# EAGLE design eDice-v1.2 (EAGLE 5.10)
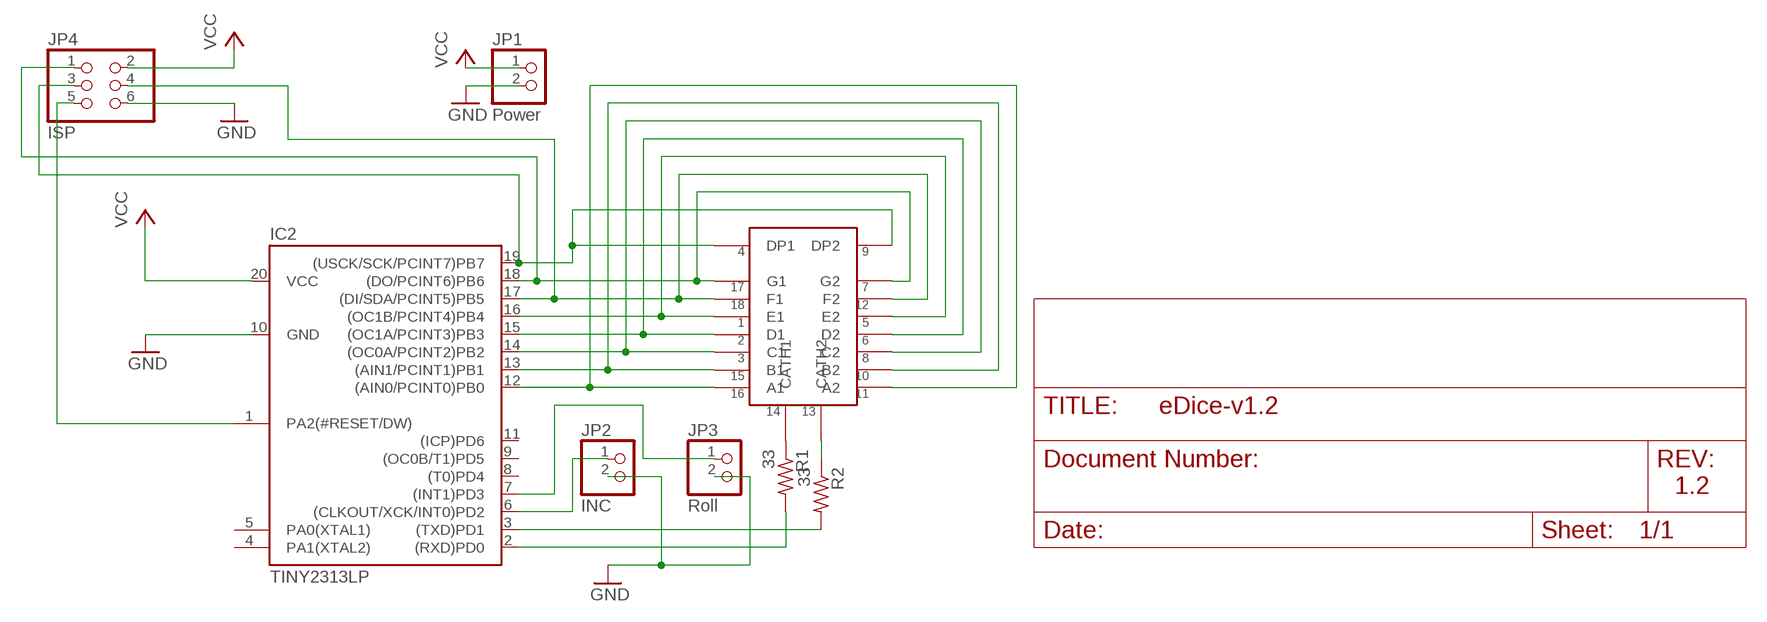
[diagram p0: schematic, sheet 1]

## Parts
IC2  TINY2313LP  [DIL20]
JP1  Power  PINHD-1X2  [1X02]
JP2  INC  PINHD-1X2  [1X02]
JP3  Roll  PINHD-1X2  [1X02]
JP4  ISP  PINHD-2X3  [2X03]
R1  33  R-US_0207/10  [0207/10]
R2  33  R-US_0207/10  [0207/10]
U$1  DUAL7SEGMENTLED  [DUAL7-SEGMENTLED]

## Nets
GND: IC2.10(GND) JP1.2 JP2.2 JP3.2 JP4.6
N$1: IC2.6((CLKOUT/XCK/INT0)PD2) JP2.1
N$2: IC2.7((INT1)PD3) JP3.1
N$3: IC2.12((AIN0/PCINT0)PB0) U$1.A1 U$1.A2
N$4: IC2.13((AIN1/PCINT1)PB1) U$1.B1 U$1.B2
N$5: IC2.14((OC0A/PCINT2)PB2) U$1.C1 U$1.C2
N$6: IC2.15((OC1A/PCINT3)PB3) U$1.D1 U$1.D2
N$7: IC2.16((OC1B/PCINT4)PB4) U$1.E1 U$1.E2
N$8: IC2.17((DI/SDA/PCINT5)PB5) JP4.4 U$1.F1 U$1.F2
N$9: R2.1 U$1.CATH2
N$10: IC2.19((USCK/SCK/PCINT7)PB7) JP4.3 U$1.DP1 U$1.DP2
N$11: R1.1 U$1.CATH1
N$12: IC2.18((DO/PCINT6)PB6) JP4.1 U$1.G1 U$1.G2
N$14: IC2.2((RXD)PD0) R1.2
N$15: IC2.3((TXD)PD1) R2.2
N$19: IC2.1(PA2(#RESET/DW)) JP4.5
VCC: IC2.20(VCC) JP1.1 JP4.2
Unconnected: IC2.4(PA1(XTAL2)) IC2.5(PA0(XTAL1)) IC2.8((T0)PD4) IC2.9((OC0B/T1)PD5) IC2.11((ICP)PD6)

## Notes on the sheet
- 1.2

## Library data of the parts
IC2 = minipov:TINY2313: 8-bit AVR Microcontroller with 2K Bytes Flash Source: http://www.atmel.com .. doc1477.pdf
JP1-JP3 = pinhead:PINHD-1X2: PIN HEADER
JP4 = pinhead:PINHD-2X3: PIN HEADER
R1 R2 = resistor:R-US_: RESISTOR, American symbol
U$1 = mkp:DUAL7SEGMENTLED: Dual 7 segment LED

## Board
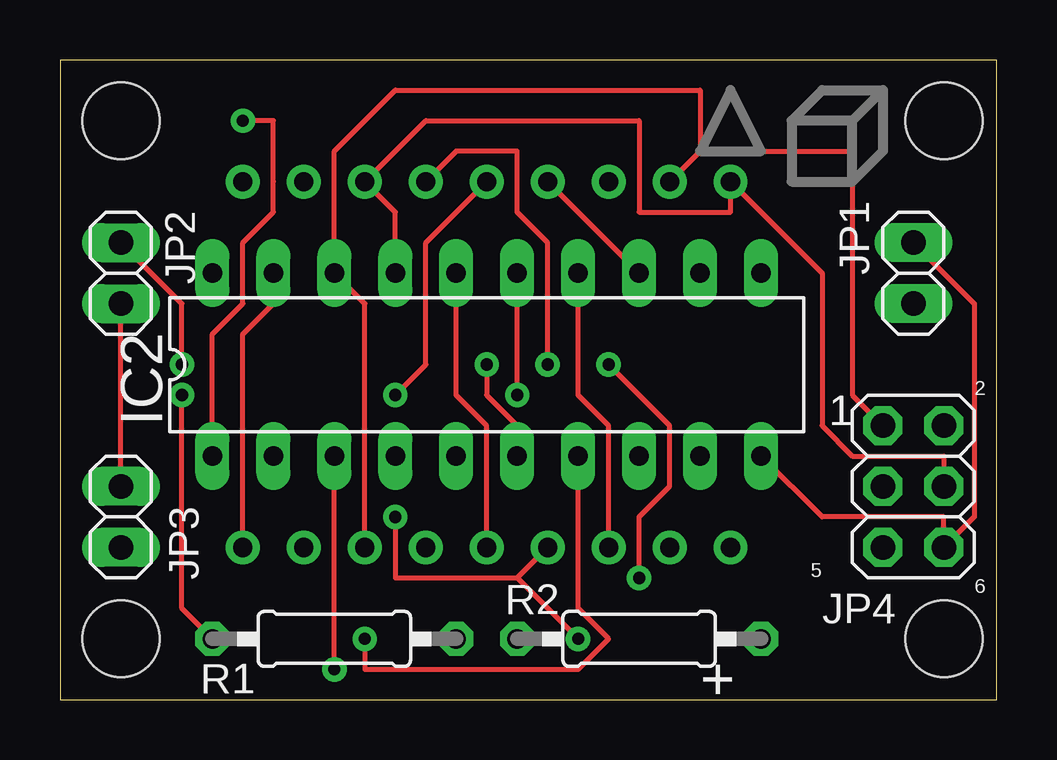
[diagram p1: board, top side]
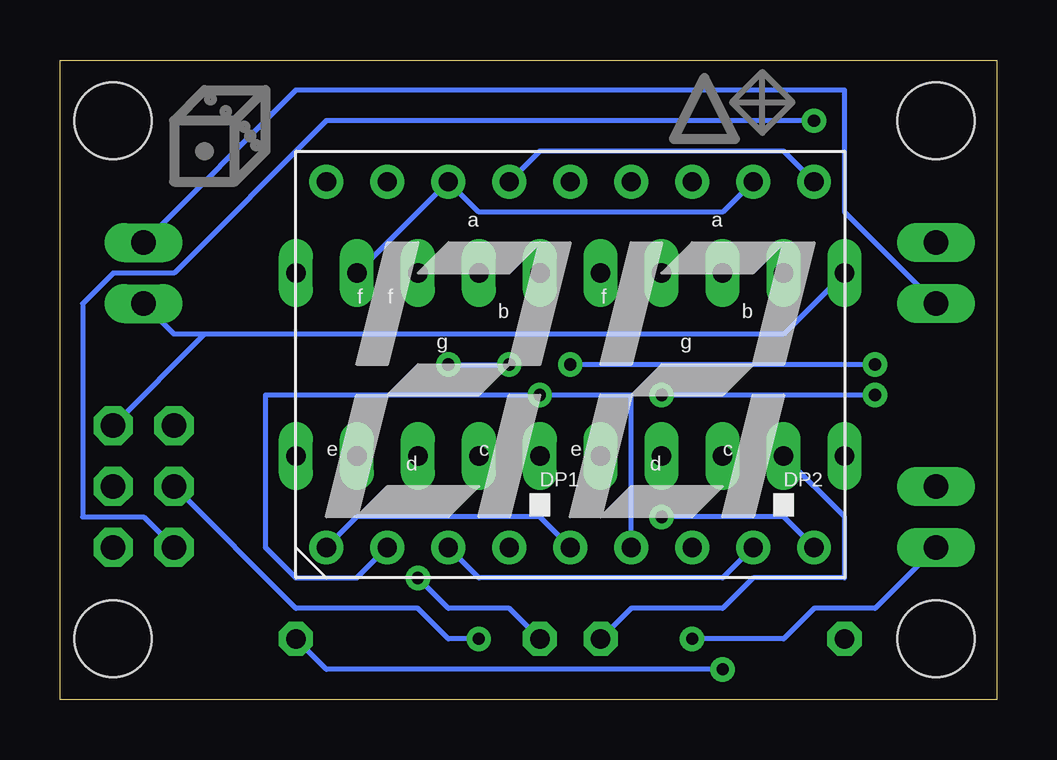
[diagram p2: board, bottom side, seen from below]

Size 39.04 x 26.66 mm. Coordinates in mm from the lower left corner, seen from the top.
Outline: 0,0 39.04,0 39.04,26.66 0,26.66 0,0
Copper layers (1*16): Top 0.035mm / dielectric 1.5mm / Bottom 0.035mm
Design rules "SparkFun": minimum track width 8mil, minimum drill 20mil, track to track 8mil, track to pad 8mil, pad to pad 8mil, via to via 8mil, smd to smd 8mil, copper to edge 10mil, drill to drill 8mil, minimum pad ring 12mil, minimum via ring 10mil, stop-mask expansion 4mil, vias tented up to drill 25mil, thermal gap 10mil
Holes 3.2 mm at 2.54,24.13 2.54,2.54 36.83,2.54 36.83,24.13

### Footprints (pad centres in the part's own frame; a part is rotated, then mirrored left to right if it is on the bottom)
DIL20 = drill 0.813 long: 1 -11.43,-3.81; 2 -8.89,-3.81; 3 -6.35,-3.81; 4 -3.81,-3.81; 5 -1.27,-3.81; 6 1.27,-3.81; 7 3.81,-3.81; 8 6.35,-3.81; 9 8.89,-3.81; 10 11.43,-3.81; 11 11.43,3.81; 12 8.89,3.81; 13 6.35,3.81; 14 3.81,3.81; 15 1.27,3.81; 16 -1.27,3.81; 17 -3.81,3.81; 18 -6.35,3.81; 19 -8.89,3.81; 20 -11.43,3.81
1X02 = drill 1.016 long: 1 -1.27,0; 2 1.27,0
2X03 = drill 1.016 octagon: 1 -2.54,-1.27; 2 -2.54,1.27; 3 0,-1.27; 4 0,1.27; 5 2.54,-1.27; 6 2.54,1.27
0207/10 = drill 0.813 octagon: 1 -5.08,0; 2 5.08,0
DUAL7-SEGMENTLED = drill 0.8 round: A1 -5.08,7.62; A2 7.62,7.62; B1 -2.54,7.62; B2 10.16,7.62; C1 -5.08,-7.62; C2 7.62,-7.62; CATH1 0,7.62; CATH2 2.54,7.62; D1 -7.62,-7.62; D2 2.54,-7.62; DP1 -2.54,-7.62; DP2 10.16,-7.62; E1 -10.16,-7.62; E2 0,-7.62; F1 -10.16,7.62; F2 5.08,7.62; G1 -7.62,7.62; G2 5.08,-7.62

### Placement (x,y rotation side)
IC2  17.78,13.97 0 top
JP1  35.56,17.78 90 top
JP2  2.54,17.78 270 top
JP3  2.54,7.62 90 top
JP4  35.56,8.89 270 top
R1  11.43,2.54 0 top
R2  24.13,2.54 0 top
U$1  17.78,13.97 0 bottom

### Tracks (layer width: path | path; a pad name or v marks a point on that pad's centre or on a via)
GND
  Top 0.203: JP3.2 JP2.2 | IC2.10 31.75,7.62 36.83,7.62 JP4.6 38.1,7.62 38.1,16.51 JP1.2
  Bottom 0.203: JP2.2 6.35,20.32 6.35,25.4 29.21,25.4 JP1.2
N$1  (via drill 0.51)
  Top 0.203: IC2.6 19.05,11.43 17.78,12.7 v17.78,13.97 | v5.08,13.97 5.08,16.51 JP2.1
  Bottom 0.203: v5.08,13.97 v17.78,13.97
N$2  (via drill 0.51)
  Top 0.203: IC2.7 21.59,3.81 22.86,2.54 21.59,1.27 12.7,1.27 v12.7,2.54
  Bottom 0.203: v12.7,2.54 8.89,2.54 7.62,3.81 5.08,3.81 JP3.1
N$3
  Bottom 0.203: U$1.A2 11.43,20.32 21.59,20.32 U$1.A1 IC2.12
N$4
  Top 0.203: U$1.B1 IC2.13
  Bottom 0.203: U$1.B2 8.89,22.86 19.05,22.86 U$1.B1
N$5
  Top 0.203: IC2.14 21.59,12.7 22.86,11.43 U$1.C1
  Bottom 0.203: U$1.C2 11.43,5.08 21.59,5.08 U$1.C1
N$6  (via drill 0.51)
  Top 0.203: v19.05,12.7 IC2.15
  Bottom 0.203: U$1.D2 15.24,12.7 v19.05,12.7 30.48,12.7 30.48,6.35 29.21,5.08 26.67,5.08 U$1.D1
N$7
  Top 0.203: IC2.16 16.51,12.7 17.78,11.43 U$1.E2
  Bottom 0.203: U$1.E2 19.05,7.62 26.67,7.62 U$1.E1
N$8
  Top 0.203: IC2.17 13.97,20.32 U$1.F2 15.24,24.13 24.13,24.13 24.13,20.32 27.94,20.32 U$1.F1 31.75,17.78 31.75,11.43 33.02,10.16 36.83,10.16 JP4.4
N$9  (via drill 0.51)
  Top 0.203: U$1.CATH2 16.51,22.86 19.05,22.86 19.05,20.32 20.32,19.05 v20.32,13.97 | v22.86,13.97 25.4,11.43 25.4,8.89 24.13,7.62 v24.13,5.08
  Bottom 0.203: v22.86,13.97 v20.32,13.97 | v24.13,5.08 22.86,3.81 20.32,3.81 R2.1
N$10  (via drill 0.51)
  Top 0.203: U$1.DP2 7.62,15.24 8.89,16.51 IC2.19 | 19.05,5.08 U$1.DP1 | 19.05,5.08 13.97,5.08 v13.97,7.62 | 19.05,5.08 v21.59,2.54
  Bottom 0.203: v13.97,7.62 8.89,7.62 U$1.DP2 | JP4.3 29.21,3.81 24.13,3.81 22.86,2.54 v21.59,2.54
N$11  (via drill 0.51)
  Top 0.203: U$1.CATH1 15.24,19.05 15.24,13.97 v13.97,12.7 | v5.08,12.7 5.08,3.81 R1.1
  Bottom 0.203: v5.08,12.7 v13.97,12.7
N$12
  Top 0.203: U$1.G2 12.7,16.51 IC2.18 11.43,22.86 13.97,25.4 26.67,25.4 26.67,22.86 | 26.67,22.86 U$1.G1 | 26.67,22.86 33.02,22.86 33.02,12.7 JP4.1
N$14
  Bottom 0.203: IC2.2 6.35,7.62 6.35,5.08 10.16,5.08 11.43,3.81 15.24,3.81 R1.2
N$15  (via drill 0.51)
  Top 0.203: v11.43,1.27 IC2.3
  Bottom 0.203: v11.43,1.27 27.94,1.27 R2.2
N$19  (via drill 0.51)
  Top 0.203: IC2.1 6.35,15.24 7.62,16.51 7.62,19.05 8.89,20.32 8.89,21.59 8.89,24.13 v7.62,24.13
  Bottom 0.203: v7.62,24.13 27.94,24.13 34.29,17.78 36.83,17.78 38.1,16.51 38.1,7.62 35.56,7.62 JP4.5
VCC
  Bottom 0.203: IC2.20 8.89,15.24 33.02,15.24 | 33.02,15.24 34.29,15.24 JP1.1 | 33.02,15.24 JP4.2

### Text on the board
tPlace: 1 | 2 | 5 | 6 | +
tDocu: V 1.1 | E-die | ISP
bDocu: Increment | v1.1 | E-die | Roll